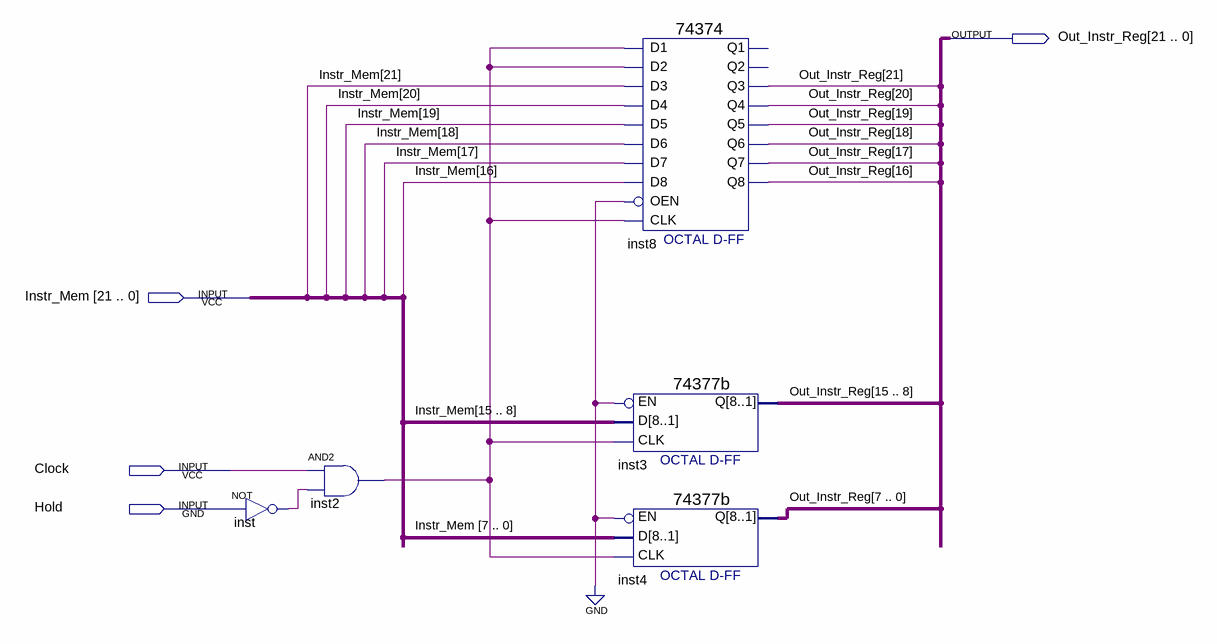
[diagram p0: schematic sheet]
// Quartus schematic Instruction_Reg.bdf as structural Verilog: 5 symbols, 4 pins
module Instruction_Reg (
  input  [21:0] Instr_Mem,
  input  Clock,
  input  Hold,
  output [21:0] Out_Instr_Reg
);

  wire inst2_out, inst_out;

  not inst (inst_out, Hold);
  and inst2 (inst2_out, Clock, inst_out);
  \74374  inst8 (
    .D1(inst2_out), .D2(inst2_out), .D3(Instr_Mem[21]), .D4(Instr_Mem[20]), .D6(Instr_Mem[18]),
    .D5(Instr_Mem[19]), .OEN(1'b0), .D8(Instr_Mem[16]), .D7(Instr_Mem[17]), .CLK(inst2_out),
    .Q3(Out_Instr_Reg[21]), .Q5(Out_Instr_Reg[19]), .Q4(Out_Instr_Reg[20]), .Q6(Out_Instr_Reg[18]),
    .Q7(Out_Instr_Reg[17]), .Q8(Out_Instr_Reg[16]));  // open: Q2, Q1
  \74377b  inst3 (.CLK(inst2_out), .EN(1'b0), .D(Instr_Mem[15:8]), .Q(Out_Instr_Reg[15:8]));
  \74377b  inst4 (.CLK(inst2_out), .EN(1'b0), .D(Instr_Mem[7:0]), .Q(Out_Instr_Reg[7:0]));
endmodule
